# EAGLE design datasette_connector (EAGLE 7.7.0)
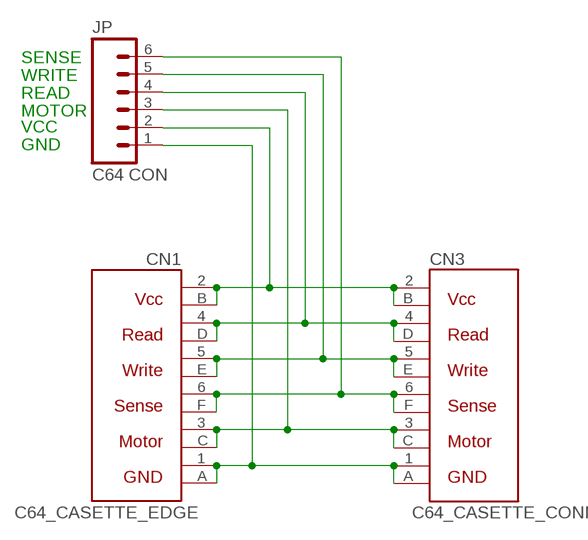
[diagram p0: schematic, sheet 1]

## Parts
CN1  C64_CASETTE_EDGE  [C64_CASSETTE]
CN3  C64_CASETTE_CONN  [C64_CASSETTE_CONN]
JP  C64 CON  M06LOCK_LONGPADS  [1X06_LOCK_LONGPADS]

## Nets
GND [GND]: CN1.1(GND1) CN1.A(GND2) CN3.1(GND1) CN3.A(GND2) JP.1
N$2: CN1.5(WRITE1) CN1.E(WRITE2) CN3.5(WRITE1) CN3.E(WRITE2) JP.5
N$13: CN1.6(SENSE1) CN1.F(SENSE2) CN3.6(SENSE1) CN3.F(SENSE2) JP.6
N$16: CN1.3(MOTOR1) CN1.C(MOTOR2) CN3.3(MOTOR1) CN3.C(MOTOR2) JP.3
N$38: CN1.4(READ1) CN1.D(READ2) CN3.4(READ1) CN3.D(READ2) JP.4
VCC [VCC]: CN1.2(VCC1) CN1.B(VCC2) CN3.2(VCC1) CN3.B(VCC2) JP.2

## Notes on the sheet
- SENSE
- WRITE
- READ
- MOTOR
- VCC
- GND

## Library data of the parts
CN1 = commodore MOD:C64_CASETTE_EDGE
CN3 = commodore:C64_CASETTE_CONN
JP = SparkFun:M06: Header 6 Standard 6-pin 0.1" header. Use with straight break away headers (SKU : PRT-00116), right angle break away headers (PRT-00553), swiss pins (PRT-00743), machine pins (PRT-00117), and female headers (PRT-00115). Molex polarized connector foot print use with SKU : PRT-08094 with associated crimp pins and housings. NOTES ON THE VARIANTS LOCK and LOCK_LONGPADS... This footprint was designed to help hold the alignment of a through-hole component (i.e. 6-pin header) while soldering it into place. You may notice that each hole has been shifted either up or down by 0.005 of an inch from it's more standard position (which is a perfectly straight line). This slight alteration caused the pins (the squares in the middle) to touch the edges of the holes. Because they are alternating, it causes a "brace" to hold the component in place. 0.005 has proven to be the perfect amount of "off-center" position when using our standard breakaway headers. Although looks a little odd when you look at the bare footprint, once you have a header in there, the alteration is very hard to notice. Also, if you push a header all the way into place, it is covered up entirely on the bottom side. This idea of altering the position of holes to aid alignment will be further integrated into the Sparkfun Library for other footprints. It can help hold any component with 3 or more connection pins.

## Net classes
0 default: width 0.254 mm, clearance 0.254 mm
1 GND: width 0.762 mm, clearance 0.381 mm
2 VCC: width 0.762 mm, clearance 0.381 mm

## Board
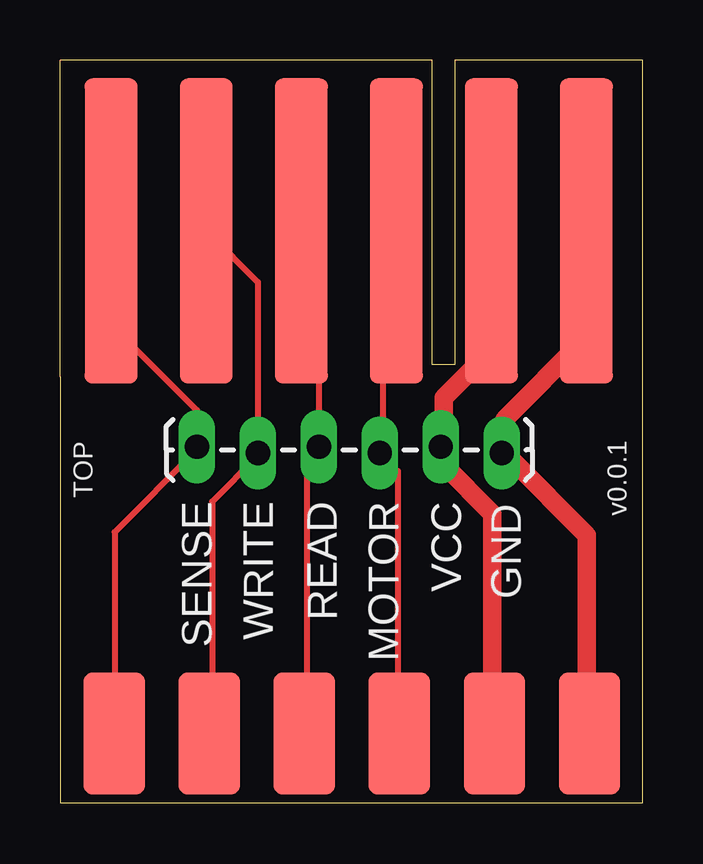
[diagram p1: board, top side]
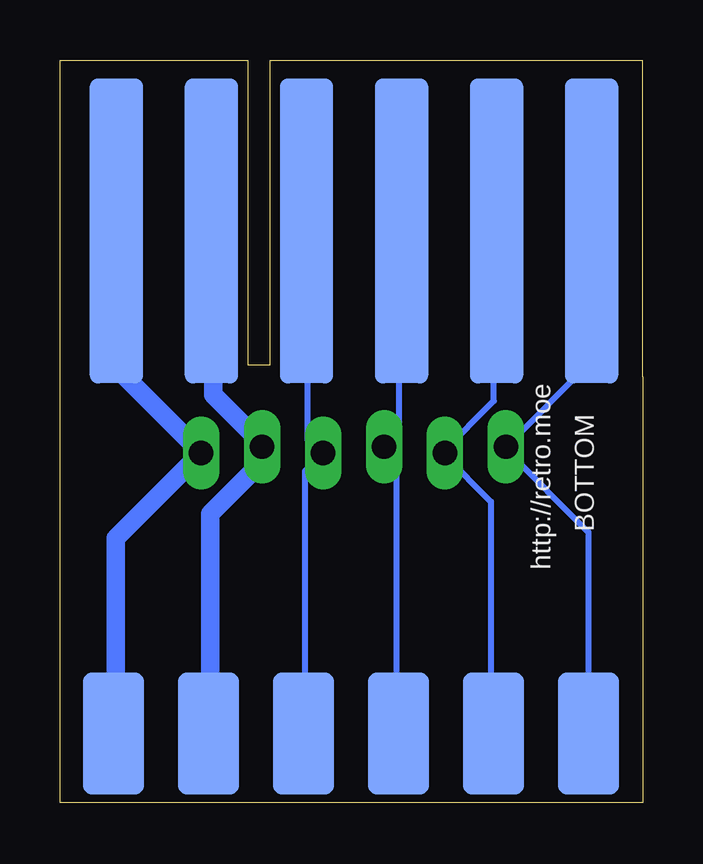
[diagram p2: board, bottom side, seen from below]

Size 24.29 x 30.94 mm. Coordinates in mm from the lower left corner, seen from the top.
Outline: 0,17.75 0,0 24.29,0 24.29,17.75
Copper layers (1*16): Top 0.035mm / dielectric 1.5mm / Bottom 0.035mm
Design rules "ITEADstudio_DRC": minimum track width 6mil, minimum drill 12mil, track to track 6mil, track to pad 6mil, pad to pad 6mil, via to via 6mil, smd to smd 0mil, copper to edge 10mil, drill to drill 10mil, minimum pad ring 10mil, minimum via ring 6mil, stop-mask expansion 2mil, vias tented up to drill 100mil, thermal gap 10mil

### Footprints (pad centres in the part's own frame; a part is rotated, then mirrored left to right if it is on the bottom)
C64_CASSETTE = smd 2.2 x 12.7: 1 -21.779,-0.5; 2 -17.819,-0.5; 3 -13.859,-0.5; 4 -9.899,-0.5; 5 -5.939,-0.5; 6 -1.979,-0.5 | smd 2.2 x 12.7 bottom: A -21.779,-0.5; B -17.819,-0.5; C -13.859,-0.5; D -9.899,-0.5; E -5.939,-0.5; F -1.979,-0.5
C64_CASSETTE_CONN = smd 2.54 x 5.08: 1 -21.779,3.68; 2 -17.819,3.68; 3 -13.859,3.68; 4 -9.899,3.68; 5 -5.939,3.68; 6 -1.979,3.68 | smd 2.54 x 5.08 bottom: A -21.779,3.68; B -17.819,3.68; C -13.859,3.68; D -9.899,3.68; E -5.939,3.68; F -1.979,3.68
1X06_LOCK_LONGPADS = drill 1.016 long: 1 0,0; 2 2.54,-0.254; 3 5.08,0; 4 7.62,-0.254; 5 10.16,0; 6 12.7,-0.254

### Placement (x,y rotation side)
CN1  0.15,23.32 180 top
CN3  0.28,-0.8 0 bottom
JP  18.41,14.57 180 top

### Tracks (layer width: path | path; a pad name or v marks a point on that pad's centre or on a via)
GND
  Top 0.762: CN1.A 21.83,23.72 21.83,19.27 18.53,15.97 18.53,14.57 JP.1 18.78,14.32 21.96,11.15 21.96,2.89 CN3.A
  Bottom 0.762: CN3.A 21.96,2.89 21.96,11.02 18.53,14.45 JP.1 18.66,14.83 21.83,18 21.83,23.72 CN1.A
N$2
  Top 0.254: CN1.E 6.21,23.72 8.24,21.69 JP.5 8.24,14.45 6.34,12.54 6.34,2.89 CN3.E
  Bottom 0.254: CN3.E 6.34,2.89 6.34,12.54 8.24,14.45 JP.5 8.37,14.57 6.21,16.73 6.21,23.72 CN1.E
N$13
  Top 0.254: CN1.F 2.15,23.72 2.15,19.91 5.7,16.35 JP.6 5.7,14.7 2.27,11.27 2.27,2.89 CN3.F
  Bottom 0.254: CN3.F 2.27,2.89 2.27,11.27 5.7,14.7 JP.6 2.15,18.39 2.15,23.72 CN1.F
N$16
  Top 0.254: CN1.C 13.96,23.72 13.45,23.21 13.45,14.57 JP.3 13.45,14.45 14.08,13.81 14.08,2.89 CN3.C
  Bottom 0.254: CN3.C 14.08,2.89 14.08,13.81 13.45,14.45 JP.3 13.45,14.57 13.96,15.08 13.96,23.72 CN1.C
N$38
  Top 0.254: CN1.D 10.15,23.72 10.78,23.08 JP.4 10.78,14.7 10.27,14.19 10.27,2.89 CN3.D
  Bottom 0.254: CN3.D 10.27,2.89 10.27,14.19 10.78,14.7 JP.4 10.15,15.46 10.15,23.72 CN1.D
VCC
  Top 0.762: CN1.B 17.89,23.72 17.89,18.77 15.99,16.86 15.99,14.83 JP.2 15.99,14.45 15.99,14.07 18.02,12.04 18.02,2.89 CN3.B
  Bottom 0.762: CN3.B 18.02,2.89 18.02,12.04 15.99,14.07 15.99,14.7 JP.2 15.99,15.08 17.89,16.99 17.89,23.72 CN1.B

### Text on the board
tPlace: TOP | SENSE | WRITE | READ | MOTOR | VCC | GND
bPlace: BOTTOM | http://retro.moe